# Altium schematic sheet F_IN_CKT.SchDoc: Title
size 420 x 297 mm; Author: G.Kasprowicz; CompanyName: WUT ISE; DrawnBy: G.Kasprowicz; Organization: WUT ISE; Address1: PW ISE; Address2: Nowowiejska 15/19 00-665 Warsaw; Address3: gkasprow@gmail.com; Revision: 2; SheetNumber: -; SheetTotal: -; ModifiedBy: -; CheckedDate: -; Title2: Title 2; DivGrp: WUT ISE; Designer: G.Kasprowicz; ModifiedDate: -; ProjectName: Sensor Box
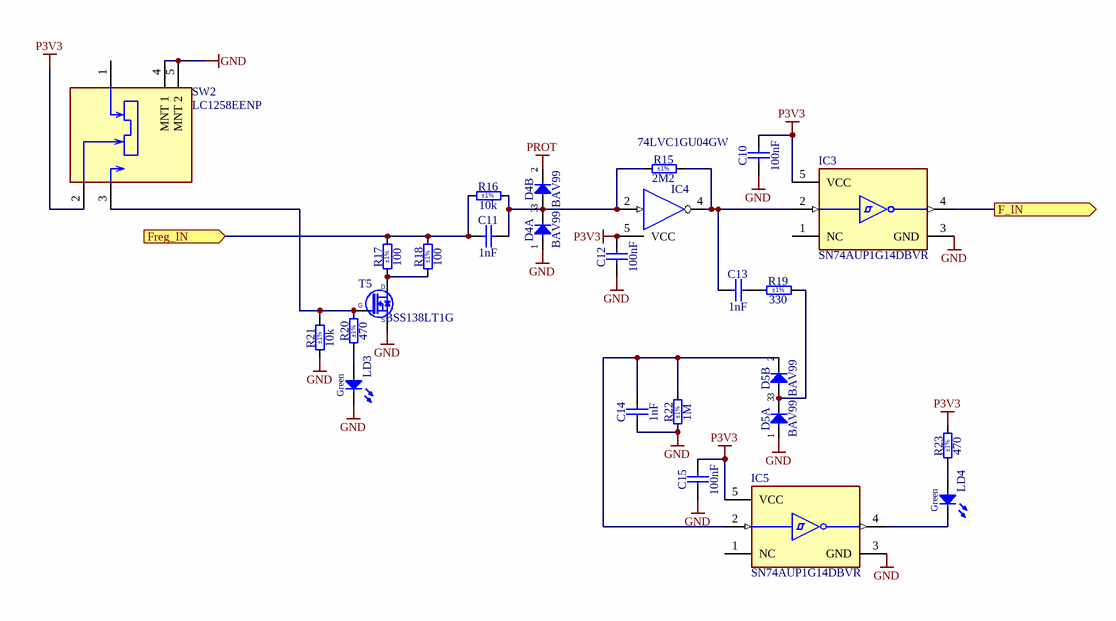
[diagram p0: F_IN_CKT.SchDoc]

## Parts
C10  100nF  [CAPC1608X90N]
C11  1nF  [CAPC1608X90N]
C12  100nF  [CAPC1608X90N]
C13  1nF  [CAPC1608X90N]
C14  1nF  [CAPC1608X90N]
C15  100nF  [CAPC1608X90N]
D4  BAV99  [SOT95P240X110-3N]  (parts A,B of 2)
D5  BAV99  [SOT95P240X110-3N]  (parts A,B of 2)
IC3  SN74AUP1G14DBVR  [FP-DBV0005A-IPC_A]
IC4  74LVC1GU04GW  [SOT65P212X110-5N]
IC5  SN74AUP1G14DBVR  [FP-DBV0005A-IPC_A]
LD3  Green  [LED_AVAGO_HSME-C110]
LD4  Green  [LED_AVAGO_HSME-C110]
R15  2M2  Tolerance: ±1%  [RESC1608X55N]
R16  10k  Tolerance: ±1%  [RESC1608X55N]
R17  100  Tolerance: ±1%  [RESC1608X55N]
R18  100  Tolerance: ±1%  [RESC1608X55N]
R19  330  Tolerance: ±1%  [RESC1608X55N]
R20  470  Tolerance: ±1%  [RESC1608X55N]
R21  10k  Tolerance: ±1%  [RESC1608X55N]
R22  1M  Tolerance: ±1%  [RESC1608X55N]
R23  470  Tolerance: ±1%  [RESC1608X55N]
SW2  LC1258EENP  [FP-LC1258EENP-MFG]
T5  BSS138LT1G  [SOT95P240X110-3N]

## Ports
F_IN (out), Freg_IN (in)

## Nets
GND: C10.1 C12.1 C14.1 C15.1 D4.1(A) D5.1(A) IC3.3(GND) IC4.3(GND) IC5.3(GND) LD3.1(C) R21.1 R22.1 SW2.4(MNT_1) SW2.5(MNT_2) T5.2(S)
P3V3: C10.2 C12.2 C15.2 IC3.5(VCC) IC4.5(VCC) IC5.5(VCC) R23.2 SW2.2
PROT: D4.2(C)
F_IN: IC3.4(Y) ; port F_IN
Freg_IN: C11.1 R16.1 R17.2 R18.2 ; port Freg_IN
NetC11_2: C11.2 D4.3(COMAC) IC4.2(IN) R15.1 R16.2
NetC13_1: C13.1 IC3.2(A) IC4.4(OUT) R15.2
NetC13_2: C13.2 R19.1
NetC14_2: C14.2 D5.2(C) IC5.2(A) R22.2
NetD5_3: D5.3(COMAC) R19.2
NetIC5_4: IC5.4(Y) LD4.1(C)
NetLD3_2: LD3.2(A) R20.1
NetLD4_2: LD4.2(A) R23.1
NetR17_1: R17.1 R18.1 T5.3(D)
NetR20_2: R20.2 R21.2 SW2.3 T5.1(G)

Not connected (* = marked no-connect by the designer): IC3 1(NC); IC5 1(NC); SW2 1

## Notes on the sheet
- Project/Equipment
- Document
- Designer
- Drawn by
- Check.by
- Copyright WUT ISE 2020.
  This documentation describes Open Hardware and is licensed under the CERN OHL v.1.2. You may redistribute and modify this documentation under the terms of the CERN OHL v.1.2. (http://ohwr.org/CERNOHL). This documentation is distributed WITHOUT ANY EXPRESS OR IMPLIED WARRANTY, INCLUDING OF MERCHANTABILITY, SATISFACTORY QUALITY AND FITNESS FOR A PARTICULAR PURPOSE. Please see the CERN OHL v.1.2 for applicable conditions.
- Contact
- File
- Last Mod.
- Print Date
- Sheet
- Size
- A3
- of
- Rev

## Library data of the parts
C10 C12 C15 = CC0603_100NF_100V_10%_X7R: Non-polarised capacitor; Part Description: SMD Multilayer Chip Ceramic Capacitor; Manufacturer: GENERIC; Manufacturer1 Part Number: GRM188R72A104KA35D; Voltage: 100V; TC: X7R; Tolerance: ±10%; Part Number: CC0603_100NF_100V_10%_X7R; Component Kind: Standard; Component Type: Standard; Pin Count: 2; Value: 100nF; Status: None; Manufacturer Part Number: CC0603_100NF_100V_10%_X7R; Case: 0603; Mounted: Yes; Socket: No; SMD: Yes; Sense: No; Manufacturer1 Example: MURATA; Manufacturer1 ComponentHeight: 0.9mm; HelpURL: \\cern.ch\dfs\Applications\Altium\Datasheets\CC0603_MURATA_GRM188R72A104KA35D.pdf; Author: CERN DEM JLC; CreateDate: 11.12.2013; LatestRevisionDate: 11.12.2013
C11 C13 C14 = CC0603_1NF_50V_1%_NP0: Non-polarised capacitor; Part Description: SMD Multilayer Chip Ceramic Capacitor; Manufacturer: GENERIC; Manufacturer1 Part Number: 06035A102FAT2A; Voltage: 50V; TC: C0G/NP0; Tolerance: ±1%; Part Number: CC0603_1NF_50V_1%_NP0; Component Kind: Standard; Component Type: Standard; Pin Count: 2; Value: 1nF; Status: None; Manufacturer Part Number: CC0603_1NF_50V_1%_NP0; Case: 0603; Mounted: Yes; Socket: No; SMD: Yes; Sense: No; Manufacturer1 Example: AVX; Manufacturer1 ComponentHeight: 0.9mm; HelpURL: \\cern.ch\dfs\Applications\Altium\Datasheets\CC0603_C0G_AVX.pdf; Author: CERN DEM JLC; CreateDate: 15.06.2017; LatestRevisionDate: 15.06.2017
D4 D5 = BAV99: Serial Diode; Part Description: Dual Series Signal Diode; Manufacturer: FAIRCHILD SEMICONDUCTOR; Voltage: 70V; Power: 350mW; PressFit: No; Bonding: No; Part Number: BAV99; Component Kind: Standard; Component Type: Standard; Device: BAV99; PackageDescription: SOT, 0.95mm Pitch; 3 Pin, 1.40mm W X 3.00mm L X 1.10mm H body, IPC Medium Density; Manufacturer Part Number: BAV99; Pin Count: 3; Case: SOT23-3; Mounted: Yes; Socket: No; SMD: Yes; Sense: No; ComponentHeight: 1.1mm; HelpURL: \\cern.ch\dfs\Applications\Altium\Datasheets\BAV99.pdf; Author: CERN DEM JLC; CreateDate: 06.05.2008; LatestRevisionDate: 27.09.2012
IC3 IC5 = CMP-0859-00076-5: IC INVERTER SCHMITT 1CH SOT23-5; Max Supply Voltage: 3.6V; Propagation Delay: 20.5ns; Quiescent Current: 500nA; Number of Elements: 1; Logic Function: Buffer; Output Current: 4mA; Turn-On Delay Time: 6.2ns; Min Supply Voltage: 800mV; Input Type: SCHMITT TRIGGER; High Level Output Current: -4mA; Mount: Surface Mount; Number of Gates: 1; Lead Free: Lead Free; Number of Inputs: 1; Number of Bits: 1; Max Operating Temperature: 85°C; Contact Plating: Gold; Case/Package: SOT-23; Weight: 0.000395oz; Technology: CMOS; Low Level Output Current: 4mA; Series: 74AUP; Packaging: Tape and Reel; Number of Circuits: 1; Package Quantity: 3000; Radiation Hardening: No; Number of Pins: 5; RoHS Compliant: Yes; REACH SVHC: No SVHC; Min Operating Temperature: -40°C
IC4 = 74LVC1GU04GW: Single Inverter Buffer; Manufacturer: NXP SEMICONDUCTORS; PressFit: No; Bonding: No; Part Number: 74LVC1GU04GW; Component Kind: Standard; Component Type: Standard; Device: 74LVC1GU04GW; PackageDescription: SOT353, SC70-5, 0.65mm Pitch; 5 Pin, 1.25mm W X 2.05mm L X 1.10mm H body, IPC Medium Density; Part Description: Inverter; Manufacturer Part Number: 74LVC1GU04GW; Pin Count: 3; Case: SOT353; Mounted: Yes; Socket: No; SMD: Yes; Sense: No; ComponentHeight: 1.1mm; Author: CERN DEM JLC; HelpURL: \\cern.ch\dfs\Applications\Altium\Datasheets\74LVC1GU04GW.pdf; CreateDate: 11.01.2011; LatestRevisionDate: 11.01.2011
LD3 LD4 = LED_AVAGO_HSME-C110: LED Green 1C 2A; Part Description: High Performance Right Angle Chip Green LED; Manufacturer: AVAGO TECHNOLOGIES; PressFit: No; Bonding: No; Part Number: LED_AVAGO_HSME-C110; Component Kind: Standard; Component Type: Standard; Color: Green; PackageDescription: Green Chip LED, 2-Leads, Body 3.3x1.6mm, Side Emitting Package; Manufacturer Part Number: HSME-C110; Pin Count: 2; Case: 1206; Mounted: Yes; Socket: No; SMD: Yes; Sense: No; ComponentHeight: 1.1mm; HelpURL: \\cern.ch\dfs\Applications\Altium\Datasheets\LED_AVAGO_HSME-C110.pdf; ComponentLink1URL: \\cern.ch\dfs\Applications\Altium\Datasheets\LED_AVAGO_HSME-C110_DESIGN-GUIDE.pdf; ComponentLink1Description: Design Guide; Author: CERN DEM JMW; CreateDate: 30.07.2009; LatestRevisionDate: 20.06.2012
R15 = R0603_2M2_1%_0.1W_100PPM: Resistor - 1%; Part Description: General Purpose Thick Film Chip Resistor; Manufacturer: GENERIC; Manufacturer1 Part Number: NRC06F2204TRF; Power: 0.1W; TC: ±100ppm/°C; PressFit: No; Part Number: R0603_2M2_1%_0.1W_100PPM; Component Kind: Standard; Component Type: Standard; Pin Count: 2; Value: 2M2; Status: Preferred; Manufacturer Part Number: R0603_2M2_1%_0.1W_100PPM; Case: 0603; Mounted: Yes; Sense: No; Socket: No; SMD: Yes; Manufacturer1 Example: NIC COMPONENT; Manufacturer1 ComponentHeight: 0.55mm; HelpURL: \\cern.ch\dfs\Applications\Altium\Datasheets\R0603_NIC_NRC.pdf; Author: CERN DEM JLC; CreateDate: 03.12.2007; LatestRevisionDate: 13.03.2008
R16 R21 = R0603_10K_1%_0.1W_100PPM: Resistor - 1%; Part Description: General Purpose Thick Film Chip Resistor; Manufacturer: GENERIC; Manufacturer1 Part Number: NRC06F1002TRF; Power: 0.1W; TC: ±100ppm/°C; PressFit: No; Part Number: R0603_10K_1%_0.1W_100PPM; Component Kind: Standard; Component Type: Standard; Pin Count: 2; Value: 10k; Status: Preferred; Manufacturer Part Number: R0603_10K_1%_0.1W_100PPM; Case: 0603; Mounted: Yes; Sense: No; Socket: No; SMD: Yes; Manufacturer1 Example: NIC COMPONENT; Manufacturer1 ComponentHeight: 0.55mm; HelpURL: \\cern.ch\dfs\Applications\Altium\Datasheets\R0603_NIC_NRC.pdf; Author: CERN DEM JLC; CreateDate: 03.12.2007; LatestRevisionDate: 13.03.2008
R17 R18 = R0603_100R_1%_0.1W_100PPM: Resistor - 1%; Part Description: General Purpose Thick Film Chip Resistor; Manufacturer: GENERIC; Manufacturer1 Part Number: NRC06F4700TRF; Power: 0.1W; TC: ±100ppm/°C; PressFit: No; Part Number: R0603_100R_1%_0.1W_100PPM; Component Kind: Standard; Component Type: Standard; Pin Count: 2; Value: 100; Status: Preferred; Manufacturer Part Number: R0603_100R_1%_0.1W_100PPM; Case: 0603; Mounted: Yes; Sense: No; Socket: No; SMD: Yes; Manufacturer1 Example: NIC COMPONENT; Manufacturer1 ComponentHeight: 0.55mm; HelpURL: \\cern.ch\dfs\Applications\Altium\Datasheets\R0603_NIC_NRC.pdf; Author: CERN DEM JLC; CreateDate: 03.12.2007; LatestRevisionDate: 13.03.2008
R19 = R0603_330R_1%_0.1W_100PPM: Resistor - 1%; Part Description: General Purpose Thick Film Chip Resistor; Manufacturer: GENERIC; Manufacturer1 Part Number: NRC06F3300TRF; Power: 0.1W; TC: ±100ppm/°C; PressFit: No; Part Number: R0603_330R_1%_0.1W_100PPM; Component Kind: Standard; Component Type: Standard; Pin Count: 2; Value: 330; Status: Preferred; Manufacturer Part Number: R0603_330R_1%_0.1W_100PPM; Case: 0603; Mounted: Yes; Sense: No; Socket: No; SMD: Yes; Manufacturer1 Example: NIC COMPONENT; Manufacturer1 ComponentHeight: 0.55mm; HelpURL: \\cern.ch\dfs\Applications\Altium\Datasheets\R0603_NIC_NRC.pdf; Author: CERN DEM JLC; CreateDate: 03.12.2007; LatestRevisionDate: 13.03.2008
R20 R23 = R0603_470R_1%_0.1W_100PPM: Resistor - 1%; Part Description: General Purpose Thick Film Chip Resistor; Manufacturer: GENERIC; Manufacturer1 Part Number: NRC06F4700TRF; Power: 0.1W; TC: ±100ppm/°C; PressFit: No; Part Number: R0603_470R_1%_0.1W_100PPM; Component Kind: Standard; Component Type: Standard; Pin Count: 2; Value: 470; Status: Preferred; Manufacturer Part Number: R0603_470R_1%_0.1W_100PPM; Case: 0603; Mounted: Yes; Sense: No; Socket: No; SMD: Yes; Manufacturer1 Example: NIC COMPONENT; Manufacturer1 ComponentHeight: 0.55mm; HelpURL: \\cern.ch\dfs\Applications\Altium\Datasheets\R0603_NIC_NRC.pdf; Author: CERN DEM JLC; CreateDate: 03.12.2007; LatestRevisionDate: 13.03.2008
R22 = R0603_1M_1%_0.1W_100PPM: Resistor - 1%; Part Description: General Purpose Thick Film Chip Resistor; Manufacturer: GENERIC; Manufacturer1 Part Number: NRC06F1004TRF; Power: 0.1W; TC: ±100ppm/°C; PressFit: No; Part Number: R0603_1M_1%_0.1W_100PPM; Component Kind: Standard; Component Type: Standard; Pin Count: 2; Value: 1M; Status: Preferred; Manufacturer Part Number: R0603_1M_1%_0.1W_100PPM; Case: 0603; Mounted: Yes; Sense: No; Socket: No; SMD: Yes; Manufacturer1 Example: NIC COMPONENT; Manufacturer1 ComponentHeight: 0.55mm; HelpURL: \\cern.ch\dfs\Applications\Altium\Datasheets\R0603_NIC_NRC.pdf; Author: CERN DEM JLC; CreateDate: 03.12.2007; LatestRevisionDate: 13.03.2008
SW2 = CMP-17874-000001-1: SWITCH PUSHBUTTON SPDT 0.3A 30V; Manufacturer: E-Switch; Contact Resistance: 20mΩ; Contact Current Rating: 300mA; Operating Force: 230gf; Electromechanical Life: 10000Cycles; Temperature Range Low: -20°C; Mouser Description: Pushbutton Switch, Right Angle, Dpdt, On-(On), Pc Tail Terminal, Pcb Hole Count: 5; Category: Switch; Device Class L2: Switches; RoHS: TRUE; ComponentLink2URL: https://www.e-switch.com/system/asset/product_line/data_sheet/36/LC.pdf; Device Class L3: Pushbutton Switches; Package: LC1258EENP; Automotive: No; Height: 8.55mm; Temperature Range High: +85°C; Octopart: https://octopart.com/lc1258eenp-e-switch-1061525; Mount: Through Hole; Digikey Description: SWITCH PUSHBUTTON SPDT 0.3A 30V; Lead Free: Yes; Footprint Url: http://spec_sheets.e-switch.com/specs/P070130.pdf; Voltage Rating Dc: 30V; Manufacturer Part Number: LC1258EENP; Temperature: -20°C to +85°C; Device Class L1: Electromechanical; Throw Configuration: SPDT; ComponentLink2Description: Datasheet
T5 = BSS138LT1G: N-CHANNEL MOSFET WITH DIODE; Part Description: 50V, 200mA N-Channel Enhancement Mode Field-Effect Transistor; Manufacturer: ON SEMICONDUCTOR; PressFit: No; Bonding: No; Part Number: BSS138LT1G; Component Kind: Standard; Component Type: Standard; Device: BSS138LT1G; PackageDescription: SOT23, 0.95mm Pitch; 3 Pin, 1.40mm W X 3.00mm L X 1.10mm H body, IPC Medium Density; Manufacturer Part Number: BSS138L; Pin Count: 3; Case: SOT23-3; Mounted: Yes; Socket: No; SMD: Yes; Sense: No; ComponentHeight: 1.11mm; HelpURL: \\cern.ch\dfs\Applications\Altium\Datasheets\BSS138LT1G.pdf; Author: CERN DEM JLC; CreateDate: 23.03.2009; LatestRevisionDate: 25.05.2022